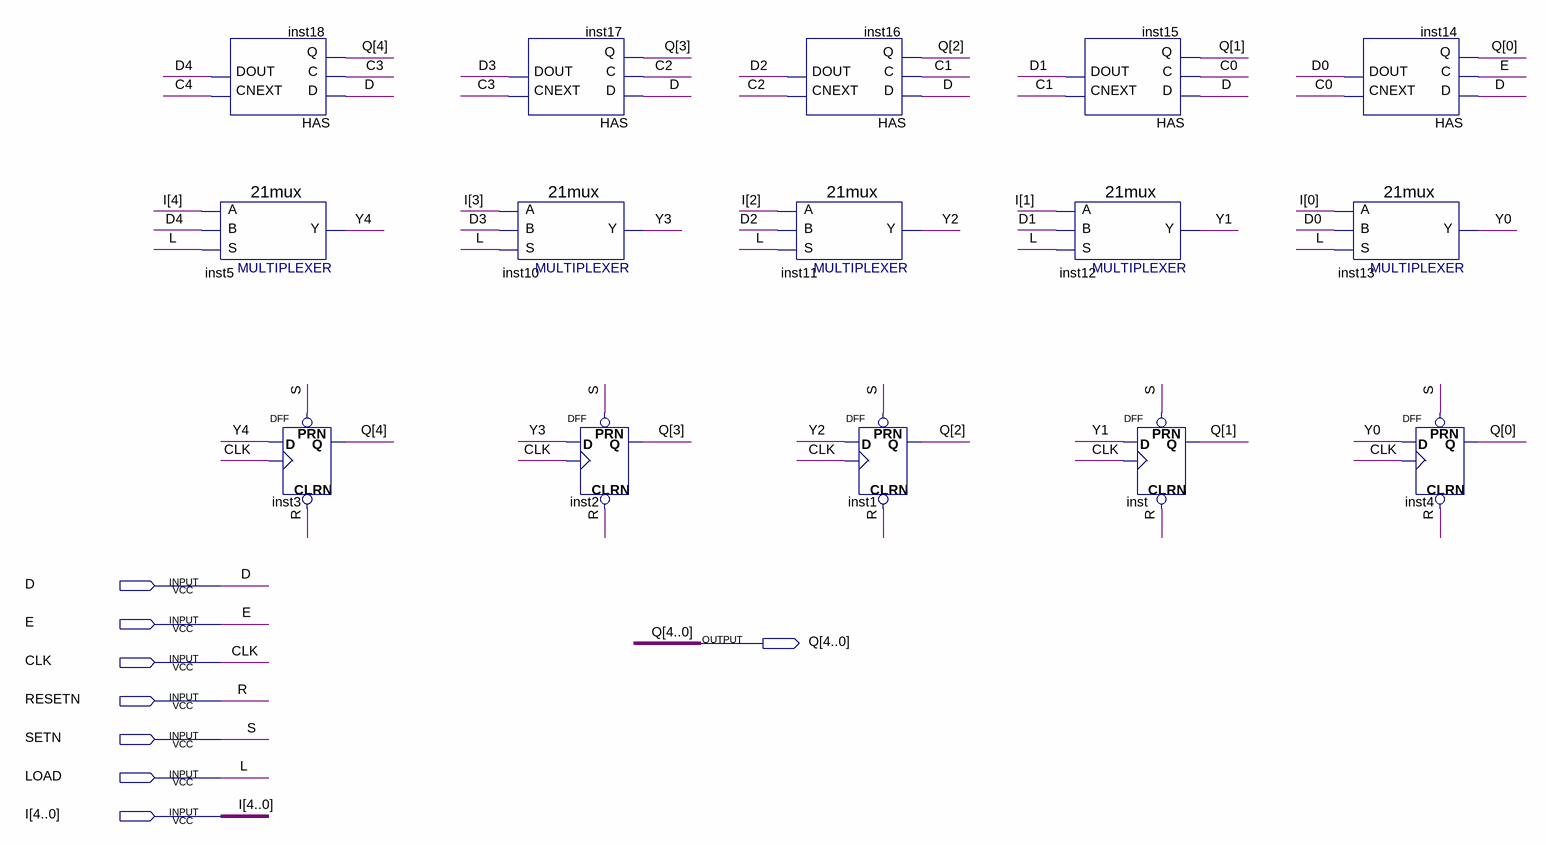
[diagram p0: schematic sheet]
// Quartus schematic COUNTER32_UP_DOWN.bdf as structural Verilog: 15 symbols, 8 pins
module COUNTER32_UP_DOWN (
  input  D,
  input  E,
  input  CLK,
  input  RESETN,
  input  SETN,
  input  LOAD,
  input  [4:0] I,
  output [4:0] Q
);

  wire C0, C1, C2, C3, C4, D0, D1, D2, D3, D4, Y0, Y1, Y2, Y3, Y4;

  HAS inst18 (.D(D), .C(C3), .Q(Q[4]), .CNEXT(C4), .DOUT(D4));
  \21mux  inst5 (.S(LOAD), .B(D4), .A(I[4]), .Y(Y4));
  DFF inst3 (.CLRN(RESETN), .CLK(CLK), .D(Y4), .PRN(SETN), .Q(Q[4]));
  HAS inst17 (.D(D), .C(C2), .Q(Q[3]), .CNEXT(C3), .DOUT(D3));
  \21mux  inst10 (.S(LOAD), .B(D3), .A(I[3]), .Y(Y3));
  DFF inst2 (.CLRN(RESETN), .CLK(CLK), .D(Y3), .PRN(SETN), .Q(Q[3]));
  HAS inst16 (.D(D), .C(C1), .Q(Q[2]), .CNEXT(C2), .DOUT(D2));
  \21mux  inst11 (.S(LOAD), .B(D2), .A(I[2]), .Y(Y2));
  DFF inst1 (.CLRN(RESETN), .CLK(CLK), .D(Y2), .PRN(SETN), .Q(Q[2]));
  HAS inst15 (.D(D), .C(C0), .Q(Q[1]), .CNEXT(C1), .DOUT(D1));
  \21mux  inst12 (.S(LOAD), .B(D1), .A(I[1]), .Y(Y1));
  DFF inst (.CLRN(RESETN), .CLK(CLK), .D(Y1), .PRN(SETN), .Q(Q[1]));
  HAS inst14 (.D(D), .C(E), .Q(Q[0]), .CNEXT(C0), .DOUT(D0));
  \21mux  inst13 (.S(LOAD), .B(D0), .A(I[0]), .Y(Y0));
  DFF inst4 (.CLRN(RESETN), .CLK(CLK), .D(Y0), .PRN(SETN), .Q(Q[0]));

  // Other names for the same wires on the sheet: L = LOAD; R = RESETN; S = SETN
endmodule
